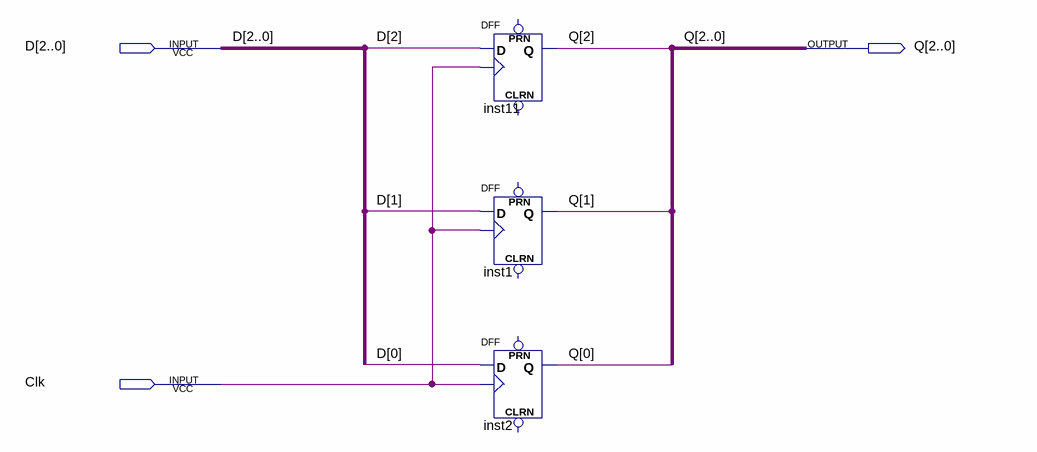
[diagram p0: schematic sheet]
// Quartus schematic Present_state.bdf as structural Verilog: 3 symbols, 3 pins
module Present_state (
  input  [2:0] D,
  input  Clk,
  output [2:0] Q
);

  DFF inst11 (.CLK(Clk), .D(D[2]), .Q(Q[2]));  // open: CLRN, PRN
  DFF inst1 (.CLK(Clk), .D(D[1]), .Q(Q[1]));  // open: CLRN, PRN
  DFF inst2 (.CLK(Clk), .D(D[0]), .Q(Q[0]));  // open: CLRN, PRN
endmodule
